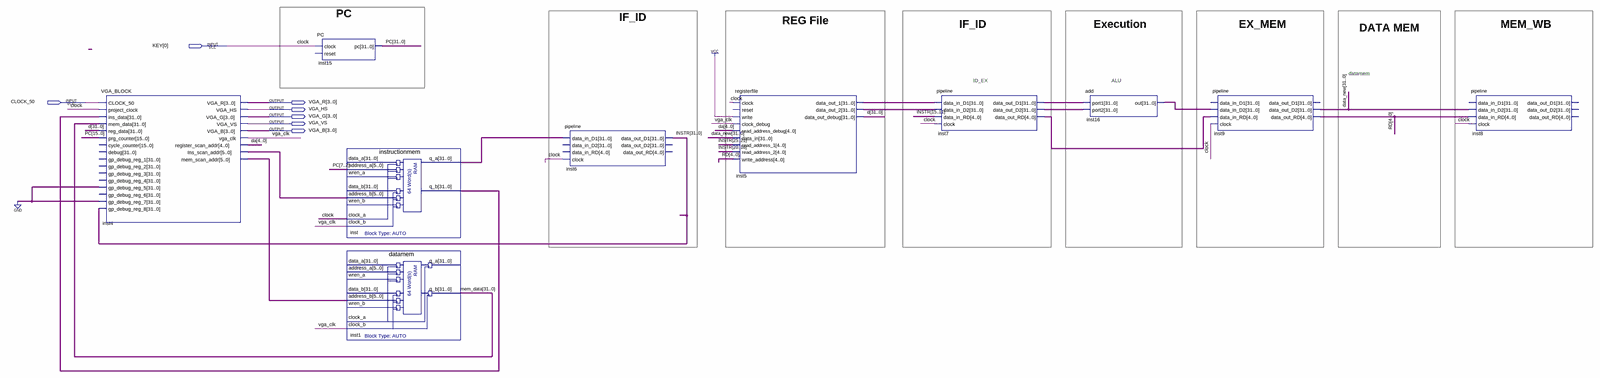
[diagram p0: schematic sheet, whole]
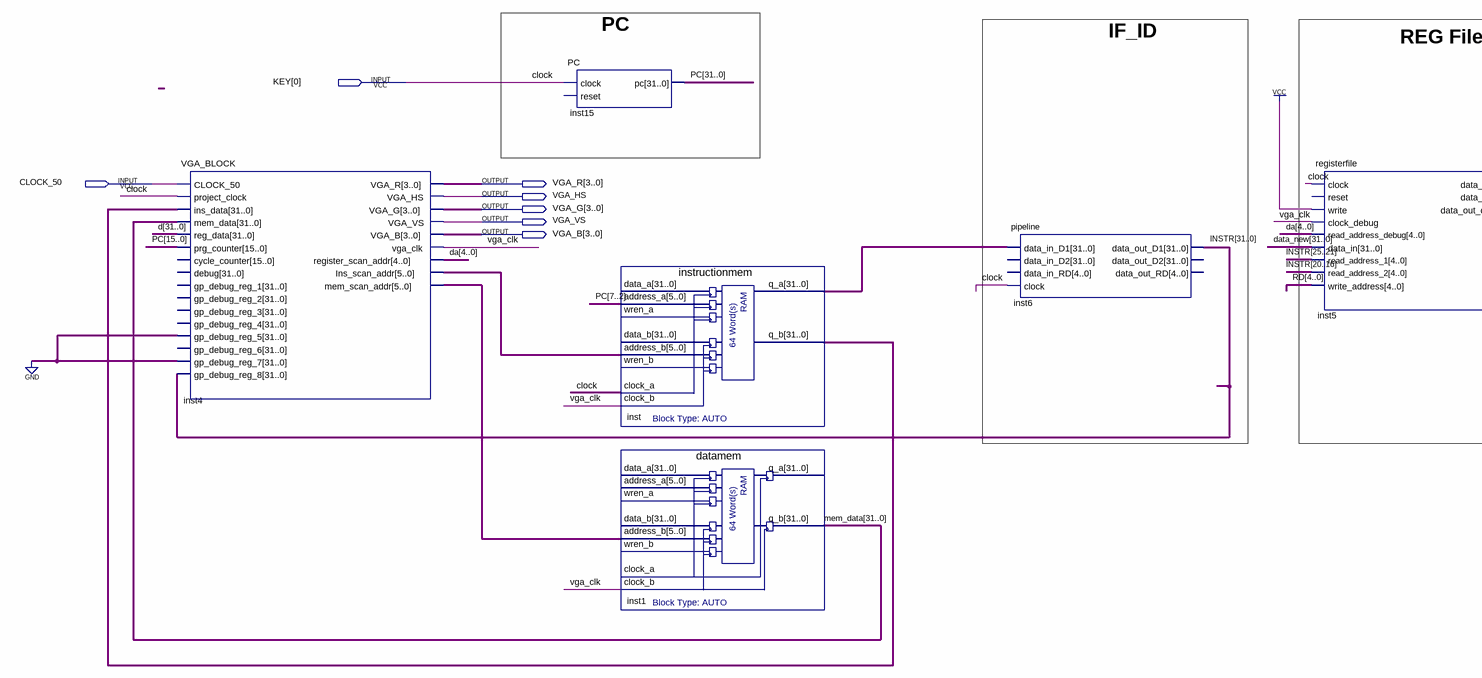
[diagram p1: schematic sheet, left part]
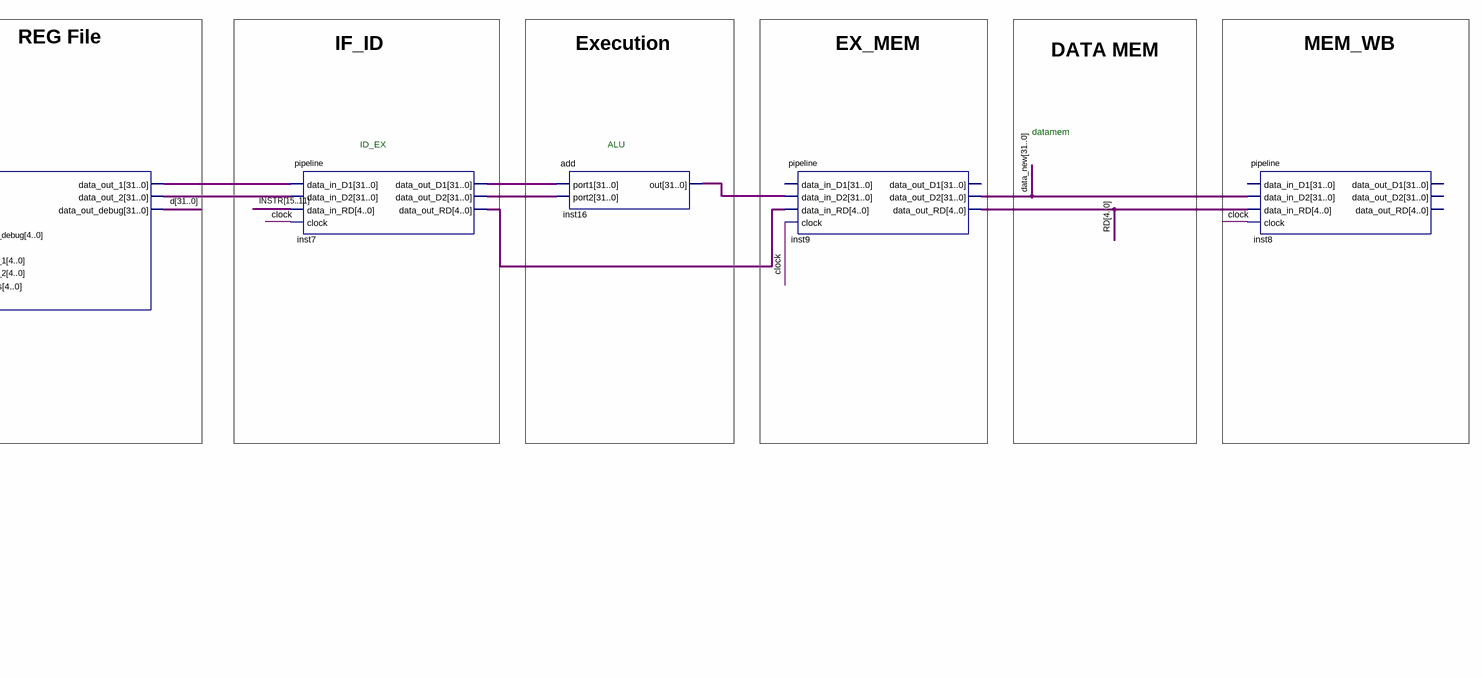
[diagram p2: schematic sheet, right part]
// Quartus schematic VGADEMO.bdf as structural Verilog: 10 symbols, 7 pins
module VGADEMO (
  input  [0:0] KEY,
  input  CLOCK_50,
  output [3:0] VGA_R,
  output VGA_HS,
  output [3:0] VGA_G,
  output VGA_VS,
  output [3:0] VGA_B
);

  wire vga_clk;
  wire [4:0] da, inst7_data_out_rd, RD;
  wire [5:0] inst4_ins_scan_addr, inst4_mem_scan_addr;
  wire [31:0] d, data_new, inst5_data_out_1, inst5_data_out_2, inst7_data_out_d1, inst7_data_out_d2,
       inst16_out, inst_q_a, inst_q_b, INSTR, mem_data, PC;

  VGA_BLOCK inst4 (
    .CLOCK_50(CLOCK_50), .project_clock(KEY[0]), .ins_data(inst_q_b), .mem_data(mem_data), .reg_data(d),
    .prg_counter(PC[15:0]), .gp_debug_reg_5({32{1'b0}}), .gp_debug_reg_7({32{1'b0}}), .gp_debug_reg_8(INSTR),
    .VGA_R(VGA_R), .VGA_HS(VGA_HS), .VGA_G(VGA_G), .VGA_VS(VGA_VS), .VGA_B(VGA_B), .vga_clk(vga_clk),
    .register_scan_addr(da), .Ins_scan_addr(inst4_ins_scan_addr), .mem_scan_addr(inst4_mem_scan_addr));  // open: cycle_counter, debug, gp_debug_reg_1, gp_debug_reg_2, gp_debug_reg_3, gp_debug_reg_4, gp_debug_reg_6
  PC inst15 (.clock(KEY[0]), .pc(PC));  // open: reset
  instructionmem inst (
    .address_a(PC[7:2]), .address_b(inst4_ins_scan_addr), .clock_a(KEY[0]), .clock_b(vga_clk),
    .q_a(inst_q_a), .q_b(inst_q_b));  // open: data_a, wren_a, data_b, wren_b
  datamem inst1 (
    .address_b(inst4_mem_scan_addr), .clock_b(vga_clk), .q_b(mem_data));  // open: data_a, address_a, wren_a, data_b, wren_b, clock_a, q_a
  pipeline inst6 (
    .clock(KEY[0]), .data_in_D1(inst_q_a), .data_out_D1(INSTR));  // open: data_in_RD, data_in_D2, data_out_D2, data_out_RD
  registerfile inst5 (
    .clock(KEY[0]), .write(1'b1), .clock_debug(vga_clk), .read_address_debug(da), .data_in(data_new),
    .read_address_1(INSTR[25:21]), .read_address_2(INSTR[20:16]), .write_address(RD),
    .data_out_1(inst5_data_out_1), .data_out_2(inst5_data_out_2), .data_out_debug(d));  // open: reset
  pipeline inst7 (
    .clock(KEY[0]), .data_in_RD(INSTR[15:11]), .data_in_D1(inst5_data_out_1), .data_in_D2(inst5_data_out_2),
    .data_out_D1(inst7_data_out_d1), .data_out_D2(inst7_data_out_d2), .data_out_RD(inst7_data_out_rd));
  add inst16 (.port1(inst7_data_out_d1), .port2(inst7_data_out_d2), .out(inst16_out));
  pipeline inst9 (
    .clock(KEY[0]), .data_in_RD(inst7_data_out_rd), .data_in_D2(inst16_out), .data_out_D2(data_new),
    .data_out_RD(RD));  // open: data_in_D1, data_out_D1
  pipeline inst8 (
    .clock(KEY[0]), .data_in_RD(RD), .data_in_D2(data_new));  // open: data_in_D1, data_out_D1, data_out_D2, data_out_RD

  // Other names for the same wires on the sheet: clock = KEY[0]

  // Notes on the sheet:
  //   PC
  //   IF_ID
  //   REG File
  //   IF_ID
  //   Execution
  //   EX_MEM
  //   MEM_WB
  //   DATA MEM
  //   datamem
  //   ID_EX
  //   ALU
endmodule
